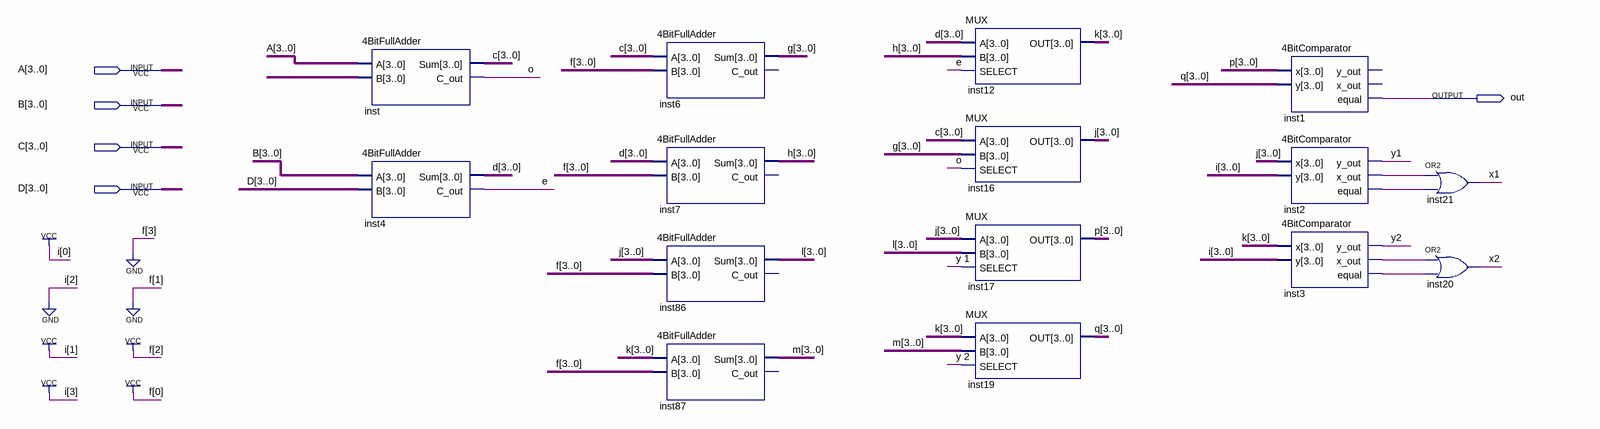
[diagram p0: schematic sheet]
// Quartus schematic main11.bdf as structural Verilog: 15 symbols, 5 pins
module main11 (
  input  [3:0] A,
  input  [3:0] B,
  input  [3:0] C,
  input  [3:0] D,
  output out
);

  wire e, inst2_equal, inst2_x_out, inst3_equal, inst3_x_out, o, x1, x2, y1, y2, \y_1 , \y_2 ;
  wire [3:0] g, h, j, k, l, m, p, q, undriven;

  \4BitFullAdder  inst (.A(A), .B(undriven), .Sum(C), .C_out(o));
  \4BitFullAdder  inst4 (.A(B), .B(D), .Sum(D), .C_out(e));
  \4BitFullAdder  inst6 (.A(C), .B(4'b0101), .Sum(g));  // open: C_out
  \4BitFullAdder  inst7 (.A(D), .B(4'b0101), .Sum(h));  // open: C_out
  \4BitFullAdder  inst86 (.A(j), .B(4'b0101), .Sum(l));  // open: C_out
  \4BitFullAdder  inst87 (.A(k), .B(4'b0101), .Sum(m));  // open: C_out
  MUX inst12 (.A(D), .B(h), .SELECT(e), .OUT(k));
  MUX inst16 (.A(C), .B(g), .SELECT(o), .OUT(j));
  MUX inst17 (.A(j), .B(l), .SELECT(\y_1 ), .OUT(p));
  MUX inst19 (.A(k), .B(m), .SELECT(\y_2 ), .OUT(q));
  \4BitComparator  inst1 (.x(p), .y(q), .equal(out));  // open: y_out, x_out
  \4BitComparator  inst2 (.x(j), .y(4'b1011), .y_out(y1), .x_out(inst2_x_out), .equal(inst2_equal));
  \4BitComparator  inst3 (.x(k), .y(4'b1011), .y_out(y2), .x_out(inst3_x_out), .equal(inst3_equal));
  or inst21 (x1, inst2_x_out, inst2_equal);
  or inst20 (x2, inst3_x_out, inst3_equal);
endmodule
